# EAGLE design Power_ToSimple (EAGLE 7.5.0)
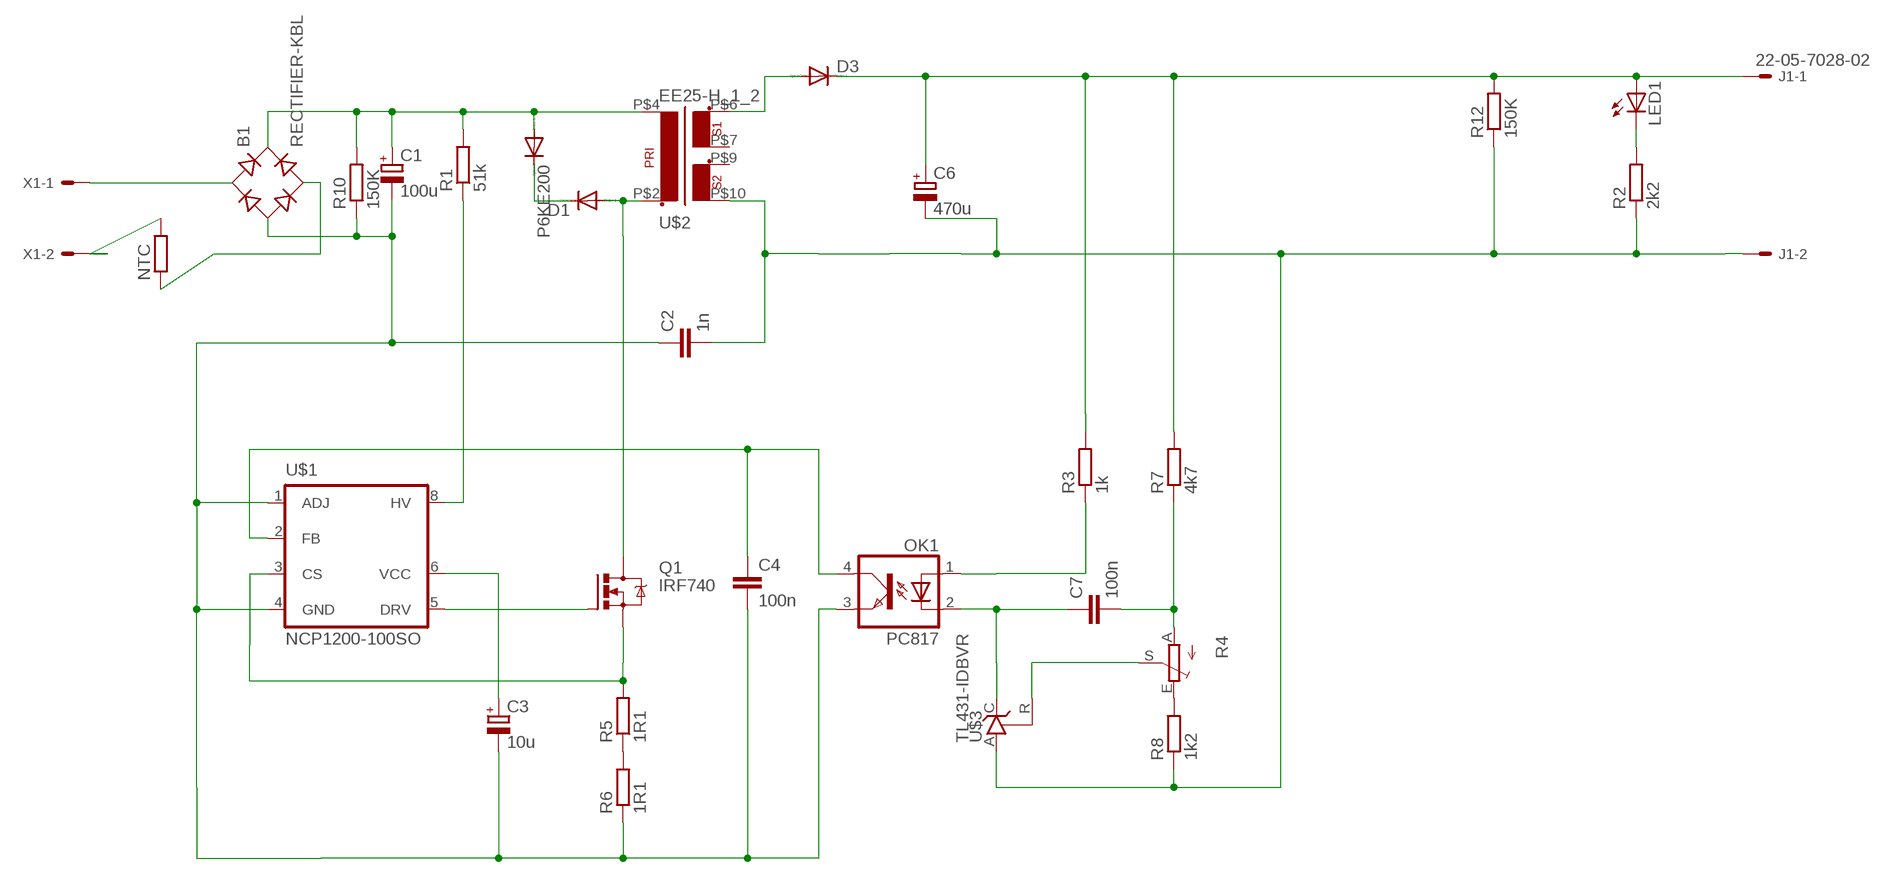
[diagram p0: schematic, sheet 1]

## Parts
B1  RECTIFIER-KBL  [KBL]
C1  100u  CPOL-EUE10-22.5  [EB22,5D]
C2  1n  C-EU050-024X044  [C050-024X044]
C3  10u  CPOL-EUE2.5-5  [E2,5-5]
C4  100n  C-EUC1206  [C1206]
C6  470u  CPOL-EUE5-10.5  [E5-10,5]
C7  100n  C-EUC1206  [C1206]
D1  DIODE-DO-214AC  [DO-214AC]
D3  DIODE-DO-214AC  [DO-214AC]
J1  22-05-7028-02  [7395-02]
LED1  LED5MM  [LED5MM]
NTC  R-EU_0207/10  [0207/10]
OK1  PC817  [DIL04]
P6KE200  DIODE-DO15-12  [DO15-12]
Q1  IRF740  [TO220BV]
R1  51k  R-EU_0922/22  [0922/22]
R2  2k2  R-EU_R1206  [R1206]
R3  1k  R-EU_R1206  [R1206]
R4  TRIM_EU-S75H  [S75H]
R5  1R1  R-EU_R1206  [R1206]
R6  1R1  R-EU_R1206  [R1206]
R7  4k7  R-EU_R1206  [R1206]
R8  1k2  R-EU_R1206  [R1206]
R10  150K  R-EU_R1206  [R1206]
R12  150K  R-EU_R1206  [R1206]
U$1  NCP1200-100SO  [SOP8]
U$2  EE25-H_1_2  [EE25]
U$3  TL431-IDBVR  [SOT23-5]
X1  KK-156-2  [KK-156-2]

## Nets
N$1: NTC.2 X1.2
N$2: B1.AC1 X1.1
N$3: B1.AC2 NTC.1
N$4: R5.1 R6.2
N$5: B1.- C1.- C2.1 C3.- C4.2 OK1.3(EMIT) R6.1 R10.1 U$1.1(ADJ) U$1.4(GND)
N$6: B1.+ C1.+ P6KE200.A R1.2 R10.2 U$2.P$4
N$7: D1.C P6KE200.C
N$8: D1.A Q1.D U$2.P$2
N$9: C2.2 C6.- J1.2 R2.1 R8.1 R12.1 U$2.P$10 U$3.A
N$10: R1.1 U$1.8(HV)
N$11: Q1.G U$1.5(DRV)
N$12: Q1.S R5.2 U$1.3(CS)
N$13: LED1.K(C) R2.2
N$14: C3.+ U$1.6(VCC)
N$15: C4.1 OK1.4(COL) U$1.2(FB)
N$17: D3.A U$2.P$6
N$18: C6.+ D3.C J1.1 LED1.A R3.2 R7.2 R12.2
N$19: R4.S U$3.R
N$20: OK1.1(A) R3.1
N$31: C7.1 OK1.2(C) U$3.C
N$32: C7.2 R4.A R7.1
N$33: R4.E R8.2
Unconnected: U$2.P$7 U$2.P$9

## Library data of the parts
B1 = rectifier:RECTIFIER-: Rectifier
C1 C3 C6 = rcl:CPOL-EU: POLARIZED CAPACITOR, European symbol
C2 C4 C7 = rcl:C-EU: CAPACITOR, European symbol
D1 D3 P6KE200 = diode:DIODE-: DIODE
J1 = con-molex:22-?-02: CONNECTOR wire to board 2.54 mm (.1 inch) pitch header; OC_FARNELL: 9731601; OC_NEWARK: unknown
LED1 = led:LED: LED OSRAM: - CHIPLED LG R971, LG N971, LY N971, LG Q971, LY Q971, LO R971, LY R971 LH N974, LH R974 LS Q976, LO Q976, LY Q976 LO Q996 - Hyper CHIPLED LW Q18S LB Q993, LB Q99A, LB R99A - SideLED LS A670, LO A670, LY A670, LG A670, LP A670 LB A673, LV A673, LT A673, LW A673 LH A674 LY A675 LS A676, LA A676, LO A676, LY A676, LW A676 LS A679, LY A679, LG A679 - Hyper Micro SIDELED® LS Y876, LA Y876, LO Y876, LY Y876 LT Y87S - SmartLED LW L88C, LW L88S LB L89C, LB L89S, LG L890 LS L89K, LO L89K, LY L89K LS L896, LA L896, LO L896, LY L896 - TOPLED LS T670, LO T670, LY T670, LG T670, LP T670 LSG T670, LSP T670, LSY T670, LOP T670, LYG T670 LG T671, LOG T671, LSG T671 LB T673, LV T673, LT T673, LW T673 LH T674 LS T676, LA T676, LO T676, LY T676, LB T676, LH T676, LSB T676, LW T676 LB T67C, LV T67C, LT T67C, LS T67K, LO T67K, LY T67K, LW E67C LS E67B, LA E67B, LO E67B, LY E67B, LB E67C, LV E67C, LT E67C LW T67C LS T679, LY T679, LG T679 LS T770, LO T770, LY T770, LG T770, LP T770 LB T773, LV T773, LT T773, LW T773 LH T774 LS E675, LA E675, LY E675, LS T675 LS T776, LA T776, LO T776, LY T776, LB T776 LHGB T686 LT T68C, LB T68C - Hyper Mini TOPLED® LB M676 - Mini TOPLED Santana® LG M470 LS M47K, LO M47K, LY M47K Source: http://www.osram.convergy.de LUXEON: - LUMILED® LXK2-PW12-R00, LXK2-PW12-S00, LXK2-PW14-U00, LXK2-PW14-V00 LXK2-PM12-R00, LXK2-PM12-S00, LXK2-PM14-U00 LXK2-PE12-Q00, LXK2-PE12-R00, LXK2-PE12-S00, LXK2-PE14-T00, LXK2-PE14-U00 LXK2-PB12-K00, LXK2-PB12-L00, LXK2-PB12-M00, LXK2-PB14-N00, LXK2-PB14-P00, LXK2-PB14-Q00 LXK2-PR12-L00, LXK2-PR12-M00, LXK2-PR14-Q00, LXK2-PR14-R00 LXK2-PD12-Q00, LXK2-PD12-R00, LXK2-PD12-S00 LXK2-PH12-R00, LXK2-PH12-S00 LXK2-PL12-P00, LXK2-PL12-Q00, LXK2-PL12-R00 Source: www.luxeon.com KINGBRIGHT: KA-3528ASYC Source: www.kingbright.com
NTC R1-R3 R5-R8 R10 R12 = rcl:R-EU_: RESISTOR, European symbol
OK1 = optocoupler:PC817: SHARP OPTO COUPLER; MPN: PC817X4J000F; OC_FARNELL: 9707727; OC_NEWARK: 97K7059
Q1 = transistor-power:IRF740: N-CHANNEL MOS FET
R4 = pot:TRIM_EU-: POTENTIOMETER
U$1 = NCP1200:NCP1200-100
U$2 = EFD25:EE25-H_1_2
U$3 = TL431:TL431-IDBVR
X1 = con-molex:KK-156-2: KK 156 HEADER Source: http://www.molex.com/pdm_docs/sd/026604100_sd.pdf; OC_FARNELL: unknown; OC_NEWARK: unknown

## Board
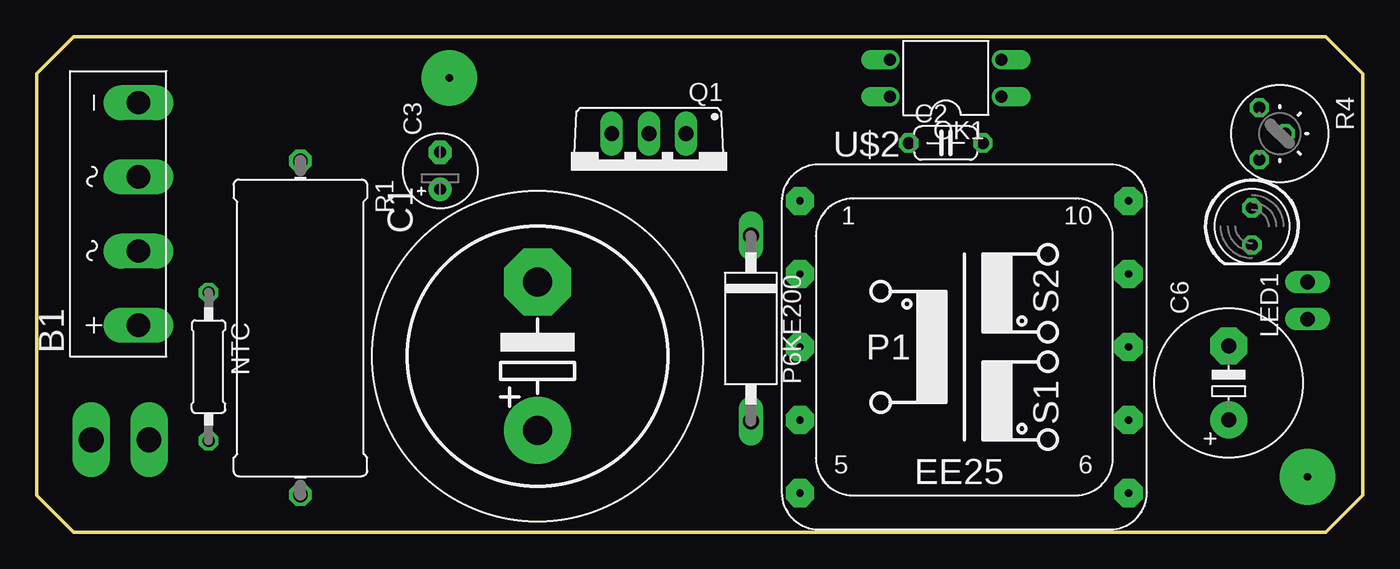
[diagram p1: board, top side]
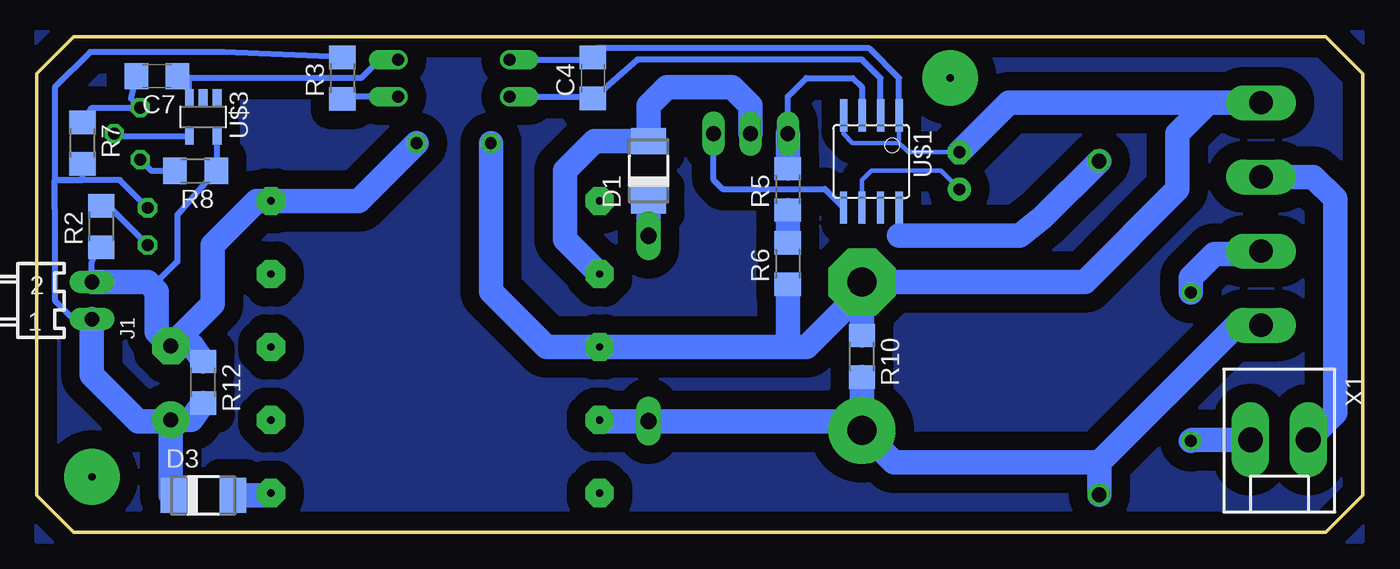
[diagram p2: board, bottom side, seen from below]

Size 90.78 x 33.96 mm. Coordinates in mm from the lower left corner, seen from the top.
Outline: 0,31.42 0,2.54 2.54,0 88.24,0 90.78,2.54 90.78,31.42 88.24,33.96 2.54,33.96 0,31.42
Copper layers (1*16): Top 0.035mm / dielectric 1.5mm / Bottom 0.035mm
Design rules "default": minimum track width 10mil, minimum drill 24mil, track to track 8mil, track to pad 8mil, pad to pad 8mil, via to via 8mil, smd to smd 8mil, copper to edge 40mil, drill to drill 8mil, minimum pad ring 10mil, minimum via ring 8mil, stop-mask expansion 4mil, vias tented up to drill 0mil, thermal gap 10mil

### Footprints (pad centres in the part's own frame; a part is rotated, then mirrored left to right if it is on the bottom)
KBL = drill 1.6 long: + -7.62,-1.27; - 7.62,-1.27; AC1 2.54,-1.27; AC2 -2.54,-1.27
EB22,5D = drill 2.007 pad 4.597: + -5.08,0 | drill 2.007 pad 4.597 octagon: - 5.08,0
C050-024X044 = drill 0.813 octagon: 1 -2.54,0; 2 2.54,0
E2,5-5 = drill 0.813 pad 1.6: + -1.27,0 | drill 0.813 pad 1.6 octagon: - 1.27,0
C1206 = smd 1.6 x 1.8: 1 -1.4,0; 2 1.4,0
E5-10,5 = drill 1.016 pad 2.54: + -2.54,0 | drill 1.016 pad 2.54 octagon: - 2.54,0
DO-214AC = smd 1.8 x 2.4: A 2.025,0; C -2.025,0
7395-02 = drill 1.016 long: 1 1.27,0; 2 -1.27,0
LED5MM = drill 0.813 octagon: A -1.27,0; K 1.27,0
0207/10 = drill 0.813 octagon: 1 -5.08,0; 2 5.08,0
DIL04 = drill 0.813 offset: 1 -1.27,-3.81; 2 1.27,-3.81; 3 1.27,3.81; 4 -1.27,3.81
DO15-12 = drill 1.118 long: A 6.35,0; C -6.35,0
TO220BV = drill 1.016 long: D 0,-2.54; G -2.54,-2.54; S 2.54,-2.54
0922/22 = drill 1.016 octagon: 1 -11.43,0; 2 11.43,0
R1206 = smd 1.6 x 1.803: 1 -1.422,0; 2 1.422,0
S75H = drill 0.813 octagon: A -1.778,-1.397; E 1.778,-1.397; S 0,0.381
SOP8 = smd 0.5 x 2.2: 1 -1.905,-3.154; 2 -0.645,-3.154; 3 0.625,-3.154; 4 1.895,-3.154; 5 1.905,3.154; 6 0.635,3.154; 7 -0.635,3.154; 8 -1.905,3.154
EE25 = drill 0.5 pad 1.93 octagon: P$1 -11.25,10; P$2 -11.25,5; P$3 -11.25,0; P$4 -11.25,-5; P$5 -11.25,-10; P$6 11.25,-10; P$7 11.25,-5; P$8 11.25,0; P$9 11.25,5; P$10 11.25,10
SOT23-5 = smd 0.6 x 1.2: + 0,-2.576; A -0.95,0.036; C 0.95,-2.576; NC -0.95,-2.576; R 0.95,0.036
KK-156-2 = drill 1.7 pad 2.184 long: 1 -1.98,0; 2 1.98,0

### Placement (x,y rotation side)
B1  5.71,21.81 90 top
C1  34.29,12.06 90 top
C2  62.23,26.67 0 top
C3  27.62,24.77 90 top
C4  52.71,31.11 90 bottom
C6  81.59,10.24 90 top
C7  82.55,31.24 180 bottom
D1  48.9,24.77 90 bottom
D3  79.38,2.54 0 bottom
J1  86.99,15.88 270 bottom
LED1  83.19,20.95 270 top
NTC  11.77,11.35 270 top
OK1  62.23,31.11 90 top
P6KE200  48.9,13.97 270 top
Q1  41.91,24.77 180 top
R1  18.06,14.01 270 top
R2  86.36,20.95 90 bottom
R3  69.85,31.11 90 bottom
R4  85.09,27.3 270 top
R5  39.37,23.5 90 bottom
R6  39.37,18.41 90 bottom
R7  87.63,26.67 270 bottom
R8  79.9,24.77 180 bottom
R10  34.29,12.06 270 bottom
R12  79.38,10.29 270 bottom
U$1  33.66,25.4 180 bottom
U$2  63.5,12.7 0 top
U$3  79.38,27.18 180 bottom
X1  5.72,6.35 180 bottom

### Tracks (layer width: path | path; a pad name or v marks a point on that pad's centre or on a via)
N$1
  Bottom 1.676: X1.2 11.69,6.35 NTC.2
N$2
  Bottom 1.676: B1.AC1 3.39,24.35 1.91,22.86 1.91,8.18 X1.1
N$3
  Bottom 1.676: NTC.1 11.77,17.44 10.16,19.05 7.2,19.05 B1.AC2
N$4
  Bottom 1.676: R5.1 R6.2
N$5
  Bottom 0.3: U$1.1 31.75,27.94 31.75,26.67 | 31.75,26.67 31.43,26.35 | 31.43,26.35 31.11,26.04 C3.- | 13.33,27.3 12.7,27.3 | U$1.4 35.55,27.29 34.93,26.67 31.75,26.67 | 31.75,26.67 31.43,26.35
  Bottom 0.406: OK1.3 53.47,32.38 C4.2 52.45,33.15 33.79,33.15 31.75,31.11 U$1.1
  Bottom 1.676: B1.- 10.58,29.43 | 10.58,29.43 12.7,27.3 12.7,23.5 19.05,17.14 24.45,17.14 24.76,17.14 33.66,17.14 | 33.66,17.14 C1.- | R10.1 C1.- | C3.- 24.23,29.43 10.58,29.43 | C2.1 59.69,24.77 59.69,23.5 59.69,16.51 55.88,12.7 48.26,12.7 39.37,12.7 | 34.8,16.64 C1.- | 39.37,12.7 38.1,12.7 33.66,17.14 | R6.1 39.37,12.7
N$6
  Bottom 1.676: B1.+ 8.67,14.19 17.78,5.08 18.06,4.8 | 18.06,4.8 R1.2 | C1.+ 32.11,4.8 18.06,4.8 | C1.+ 34.93,7.62 P6KE200.A 52.17,7.62 U$2.P$4 | R10.2 C1.+
N$7
  Bottom 1.676: P6KE200.C D1.C
N$8
  Bottom 1.676: Q1.D 41.91,29.21 43.18,30.48 47.62,30.48 48.9,29.21 D1.A 52.59,26.79 54.61,24.77 54.61,20.06 U$2.P$2
N$9
  Bottom 0.406: U$3.A 78.42,25.06 R8.1 81.16,21.73 81.16,18.54 82.87,16.83 | J1.2 86.99,18.54 R2.1
  Bottom 1.676: C6.- 81.16,13.21 78.74,15.63 78.74,19.68 75.72,22.7 U$2.P$10 68.74,22.7 C2.2 | R12.1 80.09,12.78 C6.- | J1.2 83.19,17.14 82.87,16.83 82.55,16.51 82.55,13.73 C6.-
N$10
  Bottom 0.3: 31.75,20.32 U$1.8
  Bottom 1.676: R1.1 21.9,21.59 23.49,20.32 31.11,20.32 31.75,20.32
N$11
  Bottom 0.406: Q1.G 44.45,24.13 43.84,23.52 36.83,23.52 U$1.5
N$12
  Bottom 0.406: Q1.S 39.37,29.84 38.1,31.11 34.93,31.11 34.29,30.48 34.29,28.56 U$1.3
  Bottom 1.676: Q1.S R5.2
N$13
  Bottom 0.406: R2.2 86.23,22.73 LED1.K
N$14
  Bottom 0.3: U$1.6 34.29,24.13 33.66,24.77 28.89,24.77 C3.+
N$15
  Bottom 0.406: U$1.2 33.01,31.11 34.29,32.38 49.66,32.38 C4.1 53.21,29.84 OK1.4
N$17
  Bottom 1.676: D3.A 74.75,2.54 U$2.P$6
N$18
  Bottom 0.406: J1.1 88.27,14.61 89.53,15.88 89.53,22.09 89.53,24.13 | LED1.A 85.09,24.13 86.36,24.13 87.63,24.13 | 87.63,24.13 89.53,24.13 | R3.2 77.97,32.89 87.12,32.89 89.53,30.48 89.53,24.13 | 89.53,24.13 87.63,24.13 | 87.63,24.13 R7.2
  Bottom 1.676: R12.2 80.19,7.7 C6.+ | J1.1 86.99,10.79 83.82,7.62 81.67,7.62 C6.+ | D3.C 81.59,2.54 C6.+
N$19
  Bottom 0.406: 80.32,27.62 U$3.R 85.31,27.14 R4.S
N$20
  Bottom 0.406: OK1.1 69.34,29.84 R3.1
N$28  (via drill 0.5 pad 3.81)
  other vias: 28.26,31.11
N$29  (via drill 0.5 pad 3.81)
  other vias: 86.99,3.81
N$30
  pour Bottom (isolate 1.27): 0,34.29 90.8,34.29 90.8,-0.64 0,-0.64
N$31
  Bottom 0.406: U$3.C 80.32,30.16 80.32,31.06 C7.1 80.65,31.11 68.58,31.11 67.31,32.38 OK1.2
N$32
  Bottom 0.406: C7.2 84.32,29.71 R4.A 86.99,29.08 R7.1
N$33
  Bottom 0.406: R4.E 82.93,24.77 R8.2

### Text on the board
Vias: +